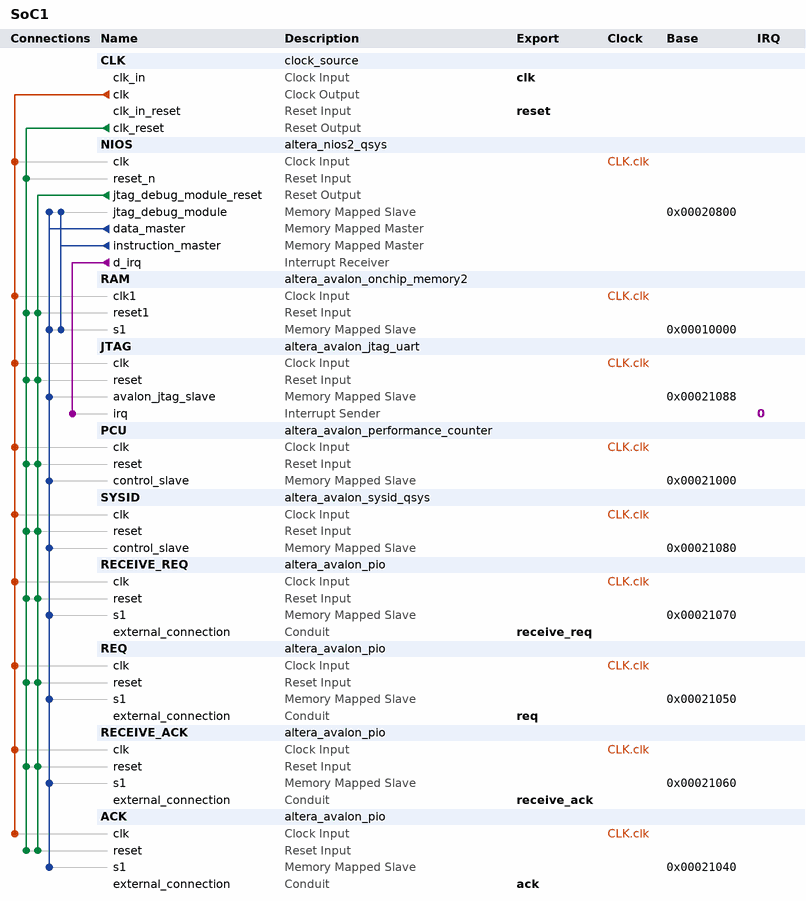
[diagram p0: system contents]
# Platform Designer (Qsys) system SoC1, Cyclone III EP3C25F324C6
# Parameters at their usual value, and those the tool derives, are not listed.
package require -exact qsys 13.0.1
create_system SoC1
set_project_property DEVICE_FAMILY {Cyclone III}
set_project_property DEVICE EP3C25F324C6

add_instance CLK clock_source 13.0
set_instance_parameter_value CLK clockFrequency 50000000

add_instance NIOS altera_nios2_qsys 13.0
set_instance_parameter_value NIOS resetSlave RAM.s1
set_instance_parameter_value NIOS mmu_TLBMissExcSlave None
set_instance_parameter_value NIOS exceptionSlave RAM.s1
set_instance_parameter_value NIOS breakSlave NIOS.jtag_debug_module
set_instance_parameter_value NIOS impl Tiny
set_instance_parameter_value NIOS icache_size 4096

add_instance RAM altera_avalon_onchip_memory2 13.0.1
set_instance_parameter_value RAM dataWidth 32
set_instance_parameter_value RAM dualPort false
set_instance_parameter_value RAM initMemContent true
set_instance_parameter_value RAM initializationFileName onchip_mem.hex
set_instance_parameter_value RAM memorySize 40960

add_instance JTAG altera_avalon_jtag_uart 13.0.1
set_instance_parameter_value JTAG simInteractiveOptions NO_INTERACTIVE_WINDOWS

add_instance PCU altera_avalon_performance_counter 13.0.1
set_instance_parameter_value PCU numberOfSections 3

add_instance SYSID altera_avalon_sysid_qsys 13.0
set_instance_parameter_value SYSID id 0

add_instance RECEIVE_REQ altera_avalon_pio 13.0.1
set_instance_parameter_value RECEIVE_REQ direction Input
set_instance_parameter_value RECEIVE_REQ width 1

add_instance REQ altera_avalon_pio 13.0.1
set_instance_parameter_value REQ direction Output
set_instance_parameter_value REQ width 1

add_instance RECEIVE_ACK altera_avalon_pio 13.0.1
set_instance_parameter_value RECEIVE_ACK direction Input
set_instance_parameter_value RECEIVE_ACK width 1

add_instance ACK altera_avalon_pio 13.0.1
set_instance_parameter_value ACK direction Output
set_instance_parameter_value ACK width 1

# connections
add_connection CLK.clk ACK.clk clock
add_connection CLK.clk JTAG.clk clock
add_connection CLK.clk NIOS.clk clock
add_connection CLK.clk PCU.clk clock
add_connection CLK.clk RAM.clk1 clock
add_connection CLK.clk RECEIVE_ACK.clk clock
add_connection CLK.clk RECEIVE_REQ.clk clock
add_connection CLK.clk REQ.clk clock
add_connection CLK.clk SYSID.clk clock
add_connection CLK.clk_reset ACK.reset reset
add_connection CLK.clk_reset JTAG.reset reset
add_connection CLK.clk_reset NIOS.reset_n reset
add_connection CLK.clk_reset PCU.reset reset
add_connection CLK.clk_reset RAM.reset1 reset
add_connection CLK.clk_reset RECEIVE_ACK.reset reset
add_connection CLK.clk_reset RECEIVE_REQ.reset reset
add_connection CLK.clk_reset REQ.reset reset
add_connection CLK.clk_reset SYSID.reset reset
add_connection NIOS.jtag_debug_module_reset ACK.reset reset
add_connection NIOS.jtag_debug_module_reset JTAG.reset reset
add_connection NIOS.jtag_debug_module_reset PCU.reset reset
add_connection NIOS.jtag_debug_module_reset RAM.reset1 reset
add_connection NIOS.jtag_debug_module_reset RECEIVE_ACK.reset reset
add_connection NIOS.jtag_debug_module_reset RECEIVE_REQ.reset reset
add_connection NIOS.jtag_debug_module_reset REQ.reset reset
add_connection NIOS.jtag_debug_module_reset SYSID.reset reset
add_connection NIOS.data_master ACK.s1 avalon
set_connection_parameter_value NIOS.data_master/ACK.s1 baseAddress 0x00021040
add_connection NIOS.data_master JTAG.avalon_jtag_slave avalon
set_connection_parameter_value NIOS.data_master/JTAG.avalon_jtag_slave baseAddress 0x00021088
add_connection NIOS.data_master NIOS.jtag_debug_module avalon
set_connection_parameter_value NIOS.data_master/NIOS.jtag_debug_module baseAddress 0x00020800
add_connection NIOS.data_master PCU.control_slave avalon
set_connection_parameter_value NIOS.data_master/PCU.control_slave baseAddress 0x00021000
add_connection NIOS.data_master RAM.s1 avalon
set_connection_parameter_value NIOS.data_master/RAM.s1 baseAddress 0x00010000
add_connection NIOS.data_master RECEIVE_ACK.s1 avalon
set_connection_parameter_value NIOS.data_master/RECEIVE_ACK.s1 baseAddress 0x00021060
add_connection NIOS.data_master RECEIVE_REQ.s1 avalon
set_connection_parameter_value NIOS.data_master/RECEIVE_REQ.s1 baseAddress 0x00021070
add_connection NIOS.data_master REQ.s1 avalon
set_connection_parameter_value NIOS.data_master/REQ.s1 baseAddress 0x00021050
add_connection NIOS.data_master SYSID.control_slave avalon
set_connection_parameter_value NIOS.data_master/SYSID.control_slave baseAddress 0x00021080
add_connection NIOS.instruction_master NIOS.jtag_debug_module avalon
set_connection_parameter_value NIOS.instruction_master/NIOS.jtag_debug_module baseAddress 0x00020800
add_connection NIOS.instruction_master RAM.s1 avalon
set_connection_parameter_value NIOS.instruction_master/RAM.s1 baseAddress 0x00010000
add_connection NIOS.d_irq JTAG.irq interrupt
set_connection_parameter_value NIOS.d_irq/JTAG.irq irqNumber 0

# exported interfaces
add_interface clk clock sink
set_interface_property clk EXPORT_OF CLK.clk_in
add_interface reset reset sink
set_interface_property reset EXPORT_OF CLK.clk_in_reset
add_interface receive_req conduit end
set_interface_property receive_req EXPORT_OF RECEIVE_REQ.external_connection
add_interface req conduit end
set_interface_property req EXPORT_OF REQ.external_connection
add_interface receive_ack conduit end
set_interface_property receive_ack EXPORT_OF RECEIVE_ACK.external_connection
add_interface ack conduit end
set_interface_property ack EXPORT_OF ACK.external_connection

set_interconnect_requirement {$system} qsys_mm.clockCrossingAdapter HANDSHAKE
set_interconnect_requirement {$system} qsys_mm.maxAdditionalLatency 1

save_system SoC1.qsys
